# Altium schematic sheet mpu9250.SchDoc
size A4; PageSetup: Record=PageOptions|CenterHorizontal=True|CenterVertical=True|PrintScale=0.97|XCorrection=1.00|YCorrection=1.00|PrintKind=2|BorderSize=5000000|LeftOffset=0|BottomOffset=0|Orientation=2|PaperLength=1000|PaperWidth=1000|Scale=100|PaperSource=7|PrintQuality=-3|MediaType=1|DitherType=10|PrintScaleMode=1|PaperKind=A4|PaperIndex=9
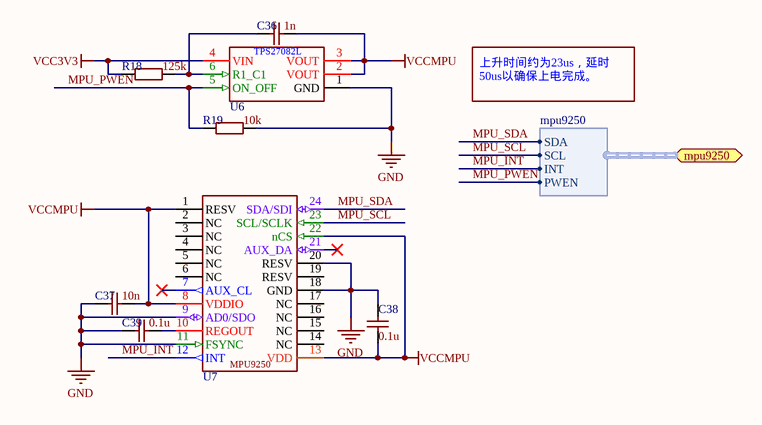
[diagram p0: mpu9250.SchDoc]

## Parts
C36  value 1n  [C0402_h]  (hidden comment: Capacitor)
C37  value 10n  [C0402_h]  (hidden comment: Capacitor)
C38  value 0.1u  [C0402_h]  (hidden comment: Capacitor)
C39  value 0.1u  [C0402_h]  (hidden comment: Capacitor)
R18  value 125k  [R0402]  (hidden comment: Register)
R19  value 10k  [R0402]  (hidden comment: Register)
U6  TPS27082L  [SOT23-6]  (value not drawn)
U7  MPU9250  [QFN24 3.0X3.0]  (value not drawn)

## Ports
mpu9250 (harness mpu9250)

## Harnesses
mpu9250: SDA, SCL, INT, PWEN

## Nets
GND: C37.1 C38.2 C39.1 R19.2 U6.1(GND) U7.9(AD0/SDO) U7.11(FSYNC) U7.18(GND) U7.20(RESV)
VCC3V3: R18.1 U6.4(VIN)
VCCMPU: C36.2 C37.2 C38.1 U6.2(VOUT) U6.3(VOUT) U7.1(RESV) U7.8(VDDIO) U7.13(VDD) U7.22(nCS)
MPU_INT: U7.12(INT) ; port mpu9250.INT
MPU_PWEN: R19.1 U6.5(ON_OFF) ; port mpu9250.PWEN
MPU_SCL: U7.23(SCL/SCLK) ; port mpu9250.SCL
MPU_SDA: U7.24(SDA/SDI) ; port mpu9250.SDA
NetC36_1: C36.1 R18.2 U6.6(R1_C1)
NetC39_2: C39.2 U7.10(REGOUT)

Not connected (* = marked no-connect by the designer): U7 2(NC) 3(NC) 4(NC) 5(NC) 6(NC) 7(AUX_CL)* 14(NC) 15(NC) 16(NC) 17(NC) 19(RESV) 21(AUX_DA)*

## Notes on the sheet
- 上升时间约为23us，延时50us以确保上电完成。

## Library data of the parts
C36-C39 = 贴片电容-无极性: VDC: 10V; Published: 8-Jun-2000; LatestRevisionDate: 17-Jul-2002; LatestRevisionNote: Re-released for DXP Platform.; PackageReference: RAD-0.3; Publisher: Altium Limited; PackageDescription: Radial Cap, Thru-Hole; 2 Leads; 0.3 in Pin Spacing
R18 R19 = 贴片电阻
U6 = TPS27082LDDCR: load switch; Manufacturer: Texas Instruments; CompType: IC; PIN_COUNT: 6; PartNumber: TPS27082LDDC; PackageReference: DDC0006A; MountType: SMT; RoHS: Y; RefDes: RefDes; Type: DEV; Value: Value
U7 = MPU9250: 9-axis MotionTracking Sensor